# Altium schematic sheet DCI_MCU_Power.SchDoc
size 420 x 297 mm; ENG_APP_DATE: --/--/--; DSN_APP_DATE: --/--/--; CHK_APP_DATE: --/--/--
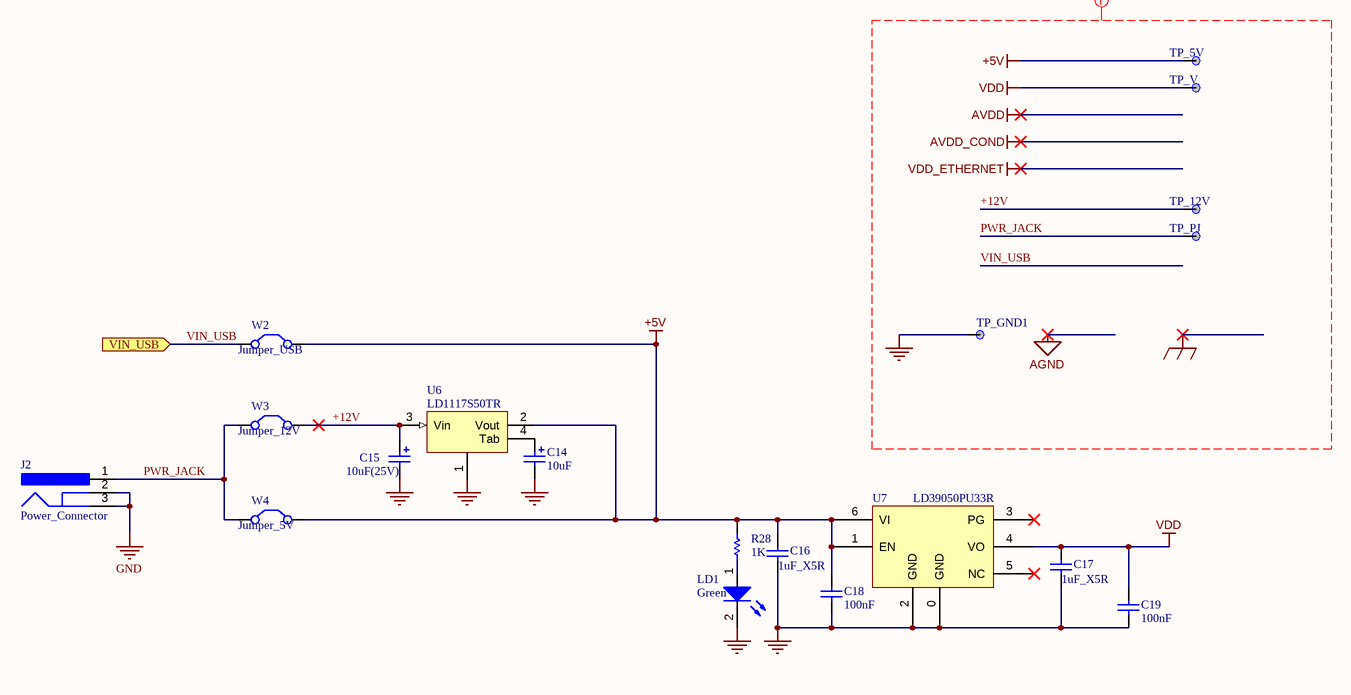
[diagram p0: DCI_MCU_Power.SchDoc]

## Parts
C14  10uF  [TAN-A - XDown]
C15  10uF(25V)  [TAN-B]
C16  1uF_X5R  [0603C]
C17  1uF_X5R  [0603C]
C18  100nF  [0603C]
C19  100nF  [0603C]
J2  Power_Connector  [CUI-PJ-002AH-4_V]
LD1  Green  [0603D-G]
R28  1K  [0603R]
TP_5V  TP_5V  [TP]  (value not drawn)
TP_12V  TP_12V  [TP]  (value not drawn)
TP_GND1  TP_GND  [TP]  (value not drawn)
TP_PJ  TP_PJ  [TP]  (value not drawn)
TP_V  TP_VDD  [TP]  (value not drawn)
U6  LD1117S50TR  [SOT-223]
U7  LD39050PU33R  [DFN6_0R95_3x3_TP]
W2  Jumper_USB  [RAD-0.2]
W3  Jumper_12V  [RAD-0.2]
W4  Jumper_5V  [RAD-0.2]

## Ports
VIN_USB (in)

## Nets
+5V: C16.1 C18.2 R28.2 TP_5V.1 U6.2(Vout) U7.1(EN) U7.6(VI) W2.2(C2) W4.2(C2)
GND: C14.2 C15.2 C16.2 C17.2 C18.1 C19.1 J2.2 J2.3 LD1.2(K) TP_GND1.1 U6.1 U7.0(GND) U7.2(GND)
VDD: C17.1 C19.2 TP_V.1 U7.4(VO)
+12V: C15.1 TP_12V.1 U6.3(Vin) W3.2(C2)
PWR_JACK: J2.1 TP_PJ.1 W3.1(C1) W4.1(C1)
VIN_USB: W2.1(C1) ; port VIN_USB
NetC14_1: C14.1 U6.4(Tab)
NetLD1_1: LD1.1(A) R28.1

Not connected (* = marked no-connect by the designer): U7 3(PG)* 5(NC)*

## Layout directives
net class PWR: +5V, +12V, AGND, AVDD, AVDD_COND, EGND, GND, PWR_JACK, VDD, VDD_ETHERNET, VIN_USB

## Notes on the sheet
- MEMBERS:
- Universitat Politècnica de València
- - Gianmarco Leopoldo Sangoi
- - Vicente Beltrán Morte
- PROJECT:
- SIZE:
- FILE NAME:
- A3
- NUMBER:
- 7
- REVISION:
- A1
- DATE:
- 07/05/2022
- SHEET
- OF

## Library data of the parts
C14 C15 = Cap Pol1: Polarized Capacitor (Radial); Published: 8-Jun-2000; Revision: July-2002: Re-released for DXP Platform.; Publisher: Altium Limited; Value: 10uF
C16 C17 = CAP SMD 0603  X5R 1µF 25V 10%: 0603  X5R 1µF; Rated voltage: 25V; Tolerance: 10%; Manufacturer: *; Manufacturer P/N: *; Order code Farnell: 1288202RL; Value: 1µF; Power: *; Technology: X5R; Temperature  Factor: *; Temperature Max: +125°C; Temperature Min: -55°C; STS Code: *
C18 C19 = Capacitor_ST: Capacitor 0402 / 0603 / 0805; Revision: July-2002: Re-released for DXP Platform.; Value: 100nF
J2 = CMP-2000-06896-1: DC Power Jack, Right Angle, -25 to 85 degC, 4-Pin 14.8 x 9 x 11 mm SMD, RoHS, Tape and Reel; Manufacturer: CUIInc.; PartNumber: PJ-002AH; Current Rating: 5A; Voltage Rating: 24V; Outside Contact Diameter: 6.5mm; Inside Contact Diameter: 2mm; Insulation Resistance: 100MOhms; Brand: CUI; Contact Plating: Nickel; Contact Gender: Male; Datasheet URL: http://www.cui.com/product/resource/pj-002ah-smt.pdf; Mounting Style: SMD/SMT; Mounting Technology: SurfaceMount; Operating Temperature Range: -25Cto+85C; Flammability Rating: UL94V-0; Mounting Angle: Right; Packaging: Reel; Connector Type: DCPowerJack; Product Category: DCPowerConnectors; Package Description: 4-Pin Surface Mount Device, Body 14.8 x 9 mm, Pitch 6.1 mm; Factory Pack Quantity: 350; Datasheet Version: Rev. 1.03, 11/2012; Contact Material: Brass; Package Reference: PJ-002AH; Housing Material: Polyamide(PA); Manufacturer URL: http://www.cui.com/; Product: Jacks; RoHS: True; Termination Style: SMD/SMT
LD1 = LED2: Typical RED, GREEN, YELLOW, AMBER GaAs LED; Published: 8-Jun-2000; Revision: July-2002: Re-released for DXP Platform.; Publisher: Altium Limited
R28 = Resistor_ST: Resistor 0402 / 0603 / 0805; Value: 10K
TP_5V TP_12V TP_GND1 TP_PJ TP_V = TP
U6 = LD1117
U7 = LD39050P
W2-W4 = Jumper: Jumper Wire; Published: 24-Mar-1999; LatestRevisionDate: 17-Jul-2002; LatestRevisionNote: Re-released for DXP Platform.; PackageReference: RAD-0.2; Publisher: Altium Limited; PackageDescription: Radial Cap, Thru-Hole; 2 Leads; 0.2 in Pin Spacing